# Altium schematic sheet pico_pga_socket.SchDoc
size B; SheetNumber: 2; SheetTotal: 2
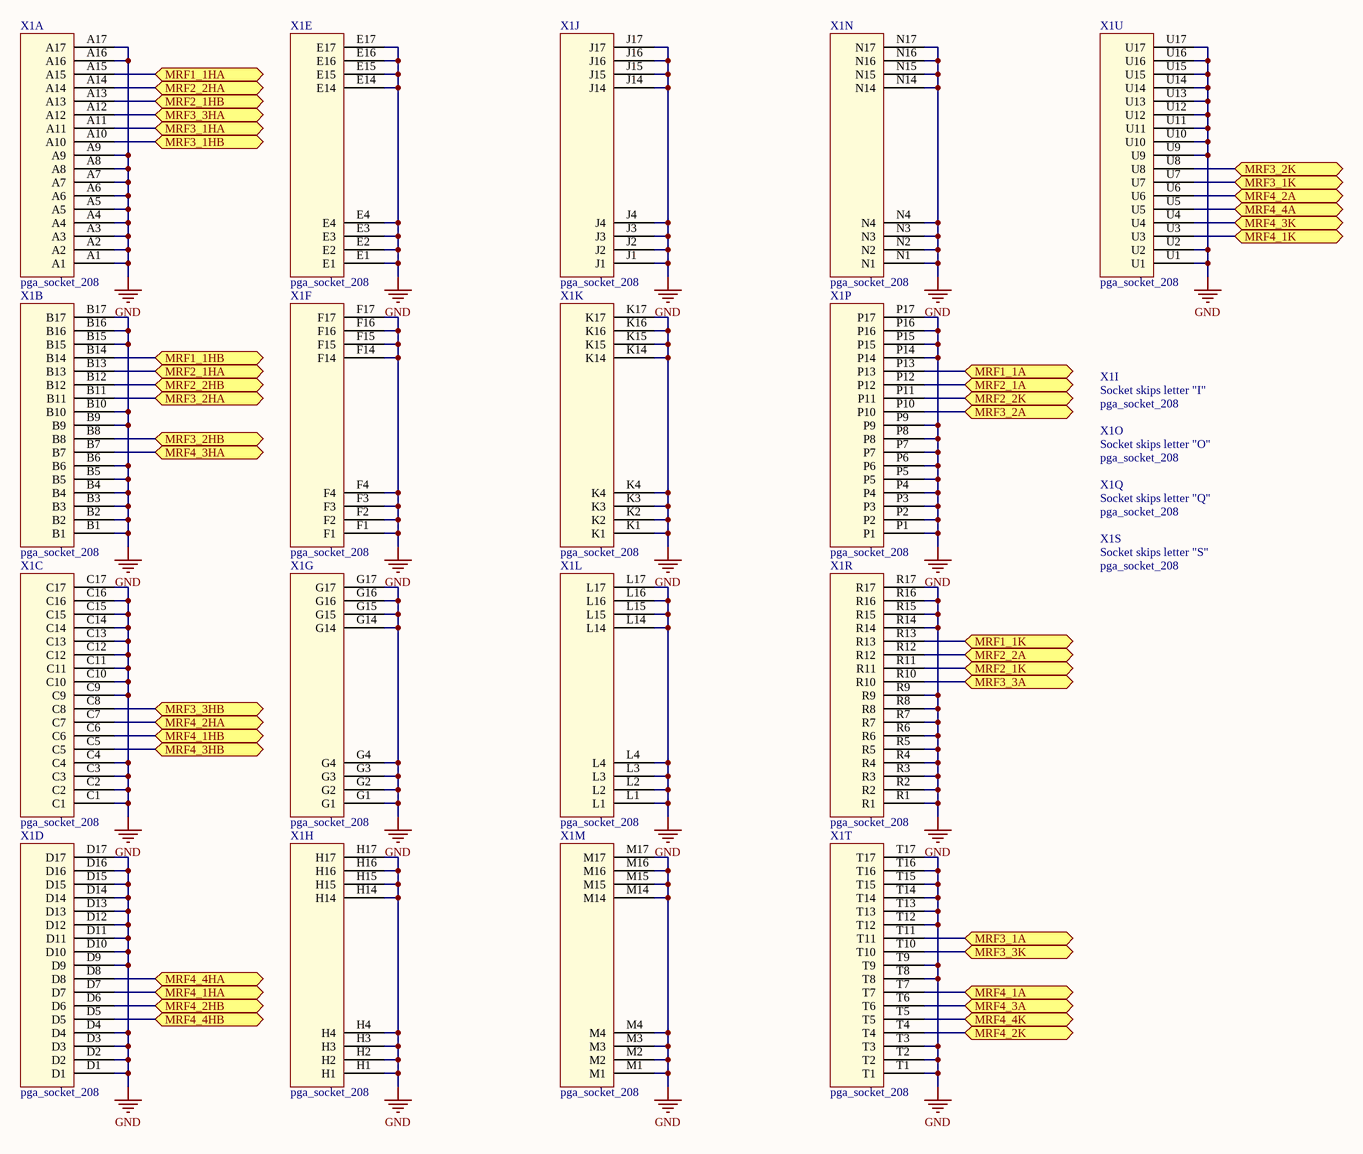
[diagram p0: pico_pga_socket.SchDoc]

## Parts
X1  pga_socket_208  [pga_socket_208pin_17x17_minus_9x9]  (parts A,B,C,D,E,F,G,H,I,J,K,L,M,N,O,P,Q,R,S,T,U of 21)

## Ports
MRF1_1A (bidir), MRF1_1HA (bidir), MRF1_1HB (bidir), MRF1_1K (bidir), MRF2_1A (bidir), MRF2_1HA (bidir), MRF2_1HB (bidir), MRF2_1K (bidir), MRF2_2A (bidir), MRF2_2HA (bidir), MRF2_2HB (bidir), MRF2_2K (bidir), MRF3_1A (bidir), MRF3_1HA (bidir), MRF3_1HB (bidir), MRF3_1K (bidir), MRF3_2A (bidir), MRF3_2HA (bidir), MRF3_2HB (bidir), MRF3_2K (bidir), MRF3_3A (bidir), MRF3_3HA (bidir), MRF3_3HB (bidir), MRF3_3K (bidir), MRF4_1A (bidir), MRF4_1HA (bidir), MRF4_1HB (bidir), MRF4_1K (bidir), MRF4_2A (bidir), MRF4_2HA (bidir), MRF4_2HB (bidir), MRF4_2K (bidir), MRF4_3A (bidir), MRF4_3HA (bidir), MRF4_3HB (bidir), MRF4_3K (bidir), MRF4_4A (bidir), MRF4_4HA (bidir), MRF4_4HB (bidir), MRF4_4K (bidir)

## Nets
GND: X1.A1 X1.A2 X1.A3 X1.A4 X1.A5 X1.A6 X1.A7 X1.A8 X1.A9 X1.A16 X1.A17 X1.B1 X1.B2 X1.B3 X1.B4 X1.B5 X1.B6 X1.B9 X1.B10 X1.B15 X1.B16 X1.B17 X1.C1 X1.C2 X1.C3 X1.C4 X1.C9 X1.C10 X1.C11 X1.C12 X1.C13 X1.C14 X1.C15 X1.C16 X1.C17 X1.D1 X1.D2 X1.D3 X1.D4 X1.D9 X1.D10 X1.D11 X1.D12 X1.D13 X1.D14 X1.D15 X1.D16 X1.D17 X1.E1 X1.E2 X1.E3 X1.E4 X1.E14 X1.E15 X1.E16 X1.E17 X1.F1 X1.F2 X1.F3 X1.F4 X1.F14 X1.F15 X1.F16 X1.F17 X1.G1 X1.G2 X1.G3 X1.G4 X1.G14 X1.G15 X1.G16 X1.G17 X1.H1 X1.H2 X1.H3 X1.H4 X1.H14 X1.H15 X1.H16 X1.H17 X1.J1 X1.J2 X1.J3 X1.J4 X1.J14 X1.J15 X1.J16 X1.J17 X1.K1 X1.K2 X1.K3 X1.K4 X1.K14 X1.K15 X1.K16 X1.K17 X1.L1 X1.L2 X1.L3 X1.L4 X1.L14 X1.L15 X1.L16 X1.L17 X1.M1 X1.M2 X1.M3 X1.M4 X1.M14 X1.M15 X1.M16 X1.M17 X1.N1 X1.N2 X1.N3 X1.N4 X1.N14 X1.N15 X1.N16 X1.N17 X1.P1 X1.P2 X1.P3 X1.P4 X1.P5 X1.P6 X1.P7 X1.P8 X1.P9 X1.P14 X1.P15 X1.P16 X1.P17 X1.R1 X1.R2 X1.R3 X1.R4 X1.R5 X1.R6 X1.R7 X1.R8 X1.R9 X1.R14 X1.R15 X1.R16 X1.R17 X1.T1 X1.T2 X1.T3 X1.T8 X1.T9 X1.T12 X1.T13 X1.T14 X1.T15 X1.T16 X1.T17 X1.U1 X1.U2 X1.U9 X1.U10 X1.U11 X1.U12 X1.U13 X1.U14 X1.U15 X1.U16 X1.U17
MRF1_1A: X1.P13 ; port MRF1_1A
MRF1_1HA: X1.A15 ; port MRF1_1HA
MRF1_1HB: X1.B14 ; port MRF1_1HB
MRF1_1K: X1.R13 ; port MRF1_1K
MRF2_1A: X1.P12 ; port MRF2_1A
MRF2_1HA: X1.B13 ; port MRF2_1HA
MRF2_1HB: X1.A13 ; port MRF2_1HB
MRF2_1K: X1.R11 ; port MRF2_1K
MRF2_2A: X1.R12 ; port MRF2_2A
MRF2_2HA: X1.A14 ; port MRF2_2HA
MRF2_2HB: X1.B12 ; port MRF2_2HB
MRF2_2K: X1.P11 ; port MRF2_2K
MRF3_1A: X1.T11 ; port MRF3_1A
MRF3_1HA: X1.A11 ; port MRF3_1HA
MRF3_1HB: X1.A10 ; port MRF3_1HB
MRF3_1K: X1.U7 ; port MRF3_1K
MRF3_2A: X1.P10 ; port MRF3_2A
MRF3_2HA: X1.B11 ; port MRF3_2HA
MRF3_2HB: X1.B8 ; port MRF3_2HB
MRF3_2K: X1.U8 ; port MRF3_2K
MRF3_3A: X1.R10 ; port MRF3_3A
MRF3_3HA: X1.A12 ; port MRF3_3HA
MRF3_3HB: X1.C8 ; port MRF3_3HB
MRF3_3K: X1.T10 ; port MRF3_3K
MRF4_1A: X1.T7 ; port MRF4_1A
MRF4_1HA: X1.D7 ; port MRF4_1HA
MRF4_1HB: X1.C6 ; port MRF4_1HB
MRF4_1K: X1.U3 ; port MRF4_1K
MRF4_2A: X1.U6 ; port MRF4_2A
MRF4_2HA: X1.C7 ; port MRF4_2HA
MRF4_2HB: X1.D6 ; port MRF4_2HB
MRF4_2K: X1.T4 ; port MRF4_2K
MRF4_3A: X1.T6 ; port MRF4_3A
MRF4_3HA: X1.B7 ; port MRF4_3HA
MRF4_3HB: X1.C5 ; port MRF4_3HB
MRF4_3K: X1.U4 ; port MRF4_3K
MRF4_4A: X1.U5 ; port MRF4_4A
MRF4_4HA: X1.D8 ; port MRF4_4HA
MRF4_4HB: X1.D5 ; port MRF4_4HB
MRF4_4K: X1.T5 ; port MRF4_4K

## Notes on the sheet
- (in symbol pga_socket_208, part I) Socket skips letter "I"
- (in symbol pga_socket_208, part O) Socket skips letter "O"
- (in symbol pga_socket_208, part Q) Socket skips letter "Q"
- (in symbol pga_socket_208, part S) Socket skips letter "S"